# Altium project NeoCortex Alice.PrjPCB
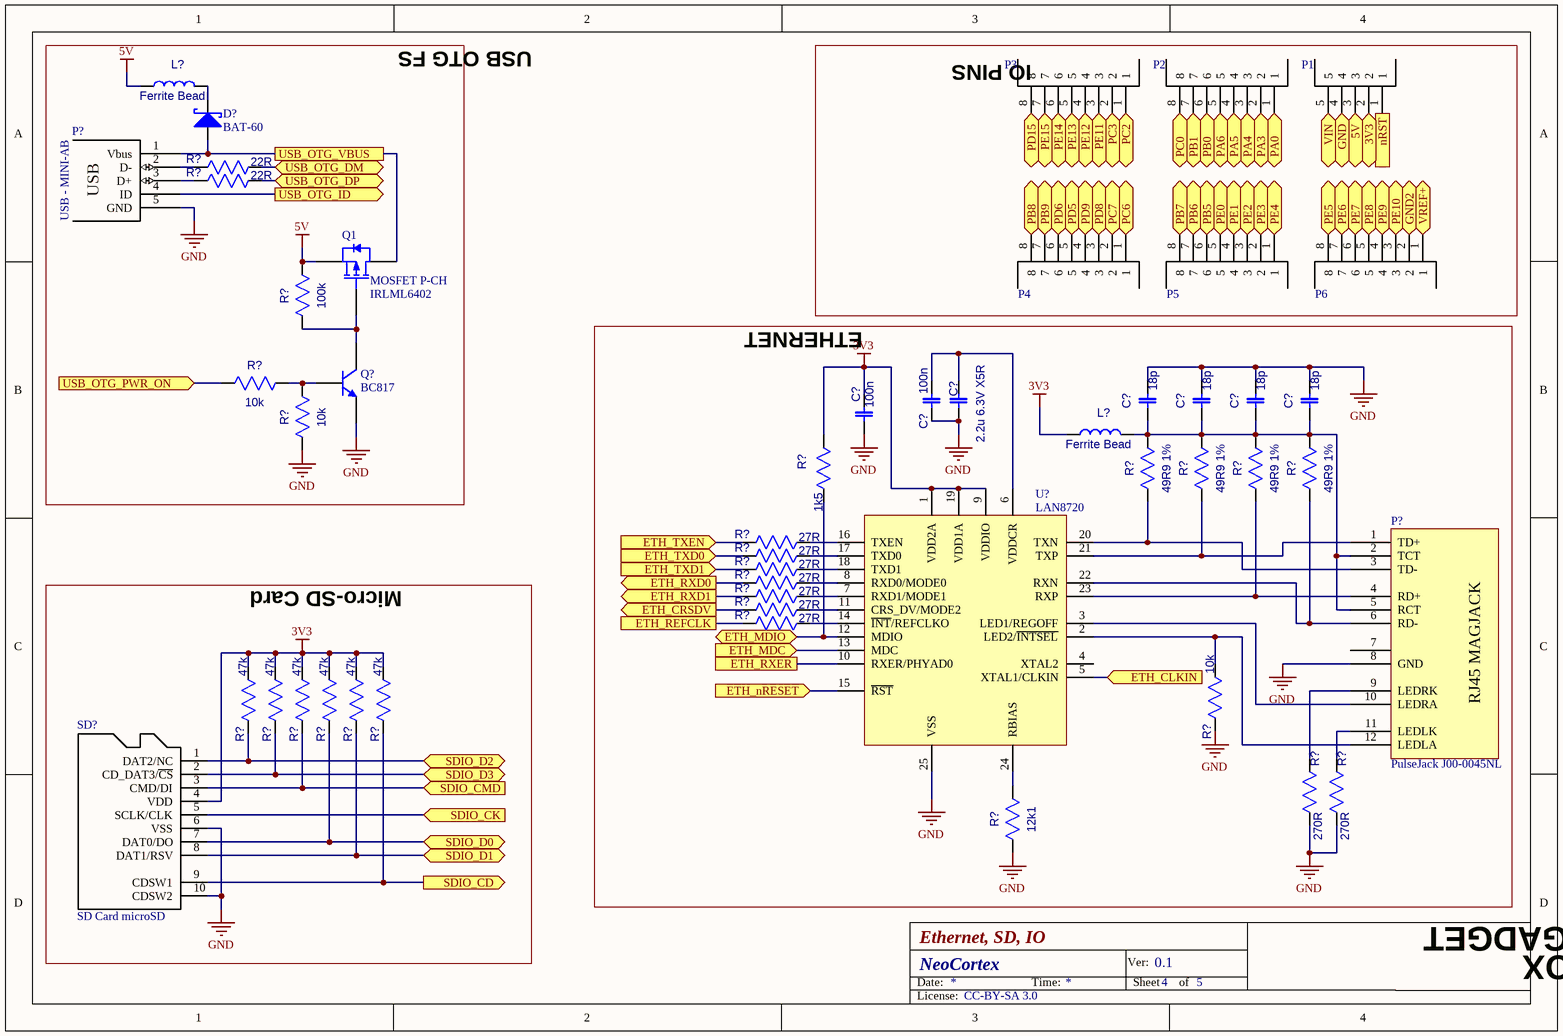
[diagram p0: Ethernet SD IO.SchDoc]
3 sheets, 55 parts. Net scope: hierarchical (ports join the sheet entries above them; power ports are global).
Board file: NeoCortex Alice.PcbDoc
Sheets:
  Ethernet SD IO.SchDoc
  NeoCortex.SchDoc
    U_Processor = Processor.SchDoc

## Sheet Ethernet SD IO.SchDoc: Ethernet, SD, IO
size A4; Organization: Gadget Sandbox; SheetNumber: 4; SheetTotal: 5; License: CC-BY-SA 3.0; Version: 0.1; Project: NeoCortex

### Parts
(Parts that share a designator on the sheet are numbered #1, #2 ... from top to bottom, then left to right.)
C?#1  2.2u 6.3V X5R  [CAP 0603]
C?#2  100n  [CAP 0805]
C?#3  18p  [CAP 0603]
C?#4  18p  [CAP 0603]
C?#5  18p  [CAP 0603]
C?#6  18p  [CAP 0603]
C?#7  100n  [CAP 0603]
D?  BAT-60  [SOD-323]
L?#1  Ferrite Bead  [IND 0603]
L?#2  Ferrite Bead  [IND 0603]
P1  CONN - 5W  [Header Female 05 2.54]  (value not drawn)
P2  CONN - 8W  [TERM-PL-8 3.81]  (value not drawn)
P3  CONN - 8W  [TERM-PL-8 3.81]  (value not drawn)
P4  CONN - 8W  [TERM-PL-8 3.81]  (value not drawn)
P5  CONN - 8W  [TERM-PL-8 3.81]  (value not drawn)
P6  CONN - 8W  [TERM-PL-8 3.81]  (value not drawn)
P?#1  USB - MINI-AB
P?#2  PulseJack J00-0045NL  [RJ45 MAGJACK STARJACK]
Q1  MOSFET P-CH  Comp2: IRLML6402  [SOT-23]
Q?  BC817  [SOT-23]
R?#1  22R  [RES 0603]
R?#2  22R  [RES 0603]
R?#3  100k  [RES 0603]
R?#4  10k  [RES 0603]
R?#5  10k  [RES 0603]
R?#6  1k5  [RES 0603]
R?#7  49R9 1%  [RES 0603]
R?#8  49R9 1%  [RES 0603]
R?#9  49R9 1%  [RES 0603]
R?#10  49R9 1%  [RES 0603]
R?#11  27R  [RES 0603]
R?#12  27R  [RES 0603]
R?#13  27R  [RES 0603]
R?#14  27R  [RES 0603]
R?#15  27R  [RES 0603]
R?#16  27R  [RES 0603]
R?#17  27R  [RES 0603]
R?#18  47k  [RES 0603]
R?#19  47k  [RES 0603]
R?#20  47k  [RES 0603]
R?#21  47k  [RES 0603]
R?#22  47k  [RES 0603]
R?#23  47k  [RES 0603]
R?#24  10k  [RES 0603]
R?#25  270R  [RES 0603]
R?#26  270R  [RES 0603]
R?#27  12k1  [RES 0603]
SD?  SD Card microSD  [SD CARD microSD 3]
U?#1  LAN8720  [QFN-24 (4x4)]

### Blocks framed on the sheet
USB OTG FS: D? L?#1 P?#1 Q1 Q? R?#1-R?#5
IO PINS: P1-P6
ETHERNET: C?#1-C?#7 L?#2 P?#2 R?#6-R?#17 R?#24-R?#27 U?#1
Micro-SD Card: R?#18-R?#23 SD?

### Ports
3V3 (bidir), 5V (bidir), ETH_CLKIN (in), ETH_CRSDV (out), ETH_MDC (in), ETH_MDIO (bidir), ETH_nRESET (in), ETH_REFCLK, ETH_RXD0 (out), ETH_RXD1 (out), ETH_RXER, ETH_TXD0 (in), ETH_TXD1 (in), ETH_TXEN (in), GND2 (bidir), GND (bidir), nRST (in), PA0 (bidir), PA3 (bidir), PA4 (bidir), PA5 (bidir), PA6 (bidir), PB0 (bidir), PB1 (bidir), PB5 (bidir), PB6 (bidir), PB7 (bidir), PB8 (bidir), PB9 (bidir), PC0 (bidir), PC2 (bidir), PC3 (bidir), PC6 (bidir), PC7 (bidir), PD5 (bidir), PD6 (bidir), PD8 (bidir), PD9 (bidir), PD15 (bidir), PE0 (bidir), PE1 (bidir), PE2 (bidir), PE3 (bidir), PE4 (bidir), PE5 (bidir), PE6 (bidir), PE7 (bidir), PE8 (bidir), PE9 (bidir), PE10 (bidir), PE11 (bidir), PE12 (bidir), PE13 (bidir), PE14 (bidir), PE15 (bidir), SDIO_CD (out), SDIO_CK (in), SDIO_CMD (in), SDIO_D0 (bidir), SDIO_D1 (bidir), SDIO_D2 (bidir), SDIO_D3 (bidir), USB_OTG_DM (bidir), USB_OTG_DP (bidir), USB_OTG_ID (out), USB_OTG_PWR_ON (in), USB_OTG_VBUS, VIN (bidir), VREF+ (bidir)

### Nets
3V3: C?#7.2 L?#2.1 R?#6.1 R?#18.1 R?#19.1 R?#20.1 R?#21.1 R?#22.1 R?#23.1 SD?.4(VDD) U?#1.1(VDD2A) U?#1.9(VDDIO) U?#1.19(VDD1A)
5V: L?#1.1 Q1.2(S) R?#3.1
GND: C?#1.2 C?#2.1 C?#3.2 C?#4.2 C?#5.2 C?#6.2 C?#7.1 P?#1.5(GND) P?#2.8(GND) Q?.2(E) R?#5.2 R?#24.2 R?#25.2 R?#26.2 R?#27.2 SD?.6(VSS) SD?.10(CDSW2) U?#1.25(VSS)
NetC?#1_1: C?#1.1 C?#2.2 U?#1.6(VDDCR)
NetC?#3_1: C?#3.1 C?#4.1 C?#5.1 C?#6.1 L?#2.2 P?#2.2(TCT) P?#2.5(RCT) R?#7.1 R?#8.1 R?#9.1 R?#10.1
NetD?_1: D?.1(A) P?#1.1(Vbus) Q1.3(D) ; port USB_OTG_VBUS
NetD?_2: D?.2(K) L?#1.2
NetP1_1: P1.1 ; port nRST
NetP1_2: P1.2 ; port 3V3
NetP1_3: P1.3 ; port 5V
NetP1_4: P1.4 ; port GND
NetP1_5: P1.5 ; port VIN
NetP2_1: P2.1 ; port PA0
NetP2_2: P2.2 ; port PA3
NetP2_3: P2.3 ; port PA4
NetP2_4: P2.4 ; port PA5
NetP2_5: P2.5 ; port PA6
NetP2_6: P2.6 ; port PB0
NetP2_7: P2.7 ; port PB1
NetP2_8: P2.8 ; port PC0
NetP3_1: P3.1 ; port PC2
NetP3_2: P3.2 ; port PC3
NetP3_3: P3.3 ; port PE11
NetP3_4: P3.4 ; port PE12
NetP3_5: P3.5 ; port PE13
NetP3_6: P3.6 ; port PE14
NetP3_7: P3.7 ; port PE15
NetP3_8: P3.8 ; port PD15
NetP4_1: P4.1 ; port PC6
NetP4_2: P4.2 ; port PC7
NetP4_3: P4.3 ; port PD8
NetP4_4: P4.4 ; port PD9
NetP4_5: P4.5 ; port PD5
NetP4_6: P4.6 ; port PD6
NetP4_7: P4.7 ; port PB9
NetP4_8: P4.8 ; port PB8
NetP5_1: P5.1 ; port PE4
NetP5_2: P5.2 ; port PE3
NetP5_3: P5.3 ; port PE2
NetP5_4: P5.4 ; port PE1
NetP5_5: P5.5 ; port PE0
NetP5_6: P5.6 ; port PB5
NetP5_7: P5.7 ; port PB6
NetP5_8: P5.8 ; port PB7
NetP6_1: P6.1 ; port VREF+
NetP6_2: P6.2 ; port GND2
NetP6_3: P6.3 ; port PE10
NetP6_4: P6.4 ; port PE9
NetP6_5: P6.5 ; port PE8
NetP6_6: P6.6 ; port PE7
NetP6_7: P6.7 ; port PE6
NetP6_8: P6.8 ; port PE5
NetP?#1_2: P?#1.2(D-) R?#1.2
NetP?#1_3: P?#1.3(D+) R?#2.2
NetP?#1_4: P?#1.4(ID) ; port USB_OTG_ID
NetP?#2_1: P?#2.1(TD+) R?#8.2 U?#1.21(TXP)
NetP?#2_3: P?#2.3(TD-) R?#7.2 U?#1.20(TXN)
NetP?#2_4: P?#2.4(RD+) R?#9.2 U?#1.23(RXP)
NetP?#2_6: P?#2.6(RD-) R?#10.2 U?#1.22(RXN)
NetP?#2_9: P?#2.9(LEDRK) R?#25.1
NetP?#2_10: P?#2.10(LEDRA) U?#1.3(LED1/REGOFF)
NetP?#2_11: P?#2.11(LEDLK) R?#26.1
NetP?#2_12: P?#2.12(LEDLA) R?#24.1 U?#1.2(LED2/~{INTSEL})
NetQ1_1: Q1.1(G) Q?.3(C) R?#3.2
NetQ?_1: Q?.1(B) R?#4.1 R?#5.1
NetR?#1_1: R?#1.1 ; port USB_OTG_DM
NetR?#2_1: R?#2.1 ; port USB_OTG_DP
NetR?#4_2: R?#4.2 ; port USB_OTG_PWR_ON
NetR?#6_2: R?#6.2 U?#1.12(MDIO) ; port ETH_MDIO
NetR?#11_1: R?#11.1 U?#1.16(TXEN)
NetR?#11_2: R?#11.2 ; port ETH_TXEN
NetR?#12_1: R?#12.1 U?#1.17(TXD0)
NetR?#12_2: R?#12.2 ; port ETH_TXD0
NetR?#13_1: R?#13.1 U?#1.18(TXD1)
NetR?#13_2: R?#13.2 ; port ETH_TXD1
NetR?#14_1: R?#14.1 U?#1.8(RXD0/MODE0)
NetR?#14_2: R?#14.2 ; port ETH_RXD0
NetR?#15_1: R?#15.1 U?#1.7(RXD1/MODE1)
NetR?#15_2: R?#15.2 ; port ETH_RXD1
NetR?#16_1: R?#16.1 U?#1.11(CRS_DV/MODE2)
NetR?#16_2: R?#16.2 ; port ETH_CRSDV
NetR?#17_1: R?#17.1 U?#1.14(~{INT}/REFCLKO)
NetR?#17_2: R?#17.2 ; port ETH_REFCLK
NetR?#18_2: R?#18.2 SD?.1(DAT2/NC) ; port SDIO_D2
NetR?#19_2: R?#19.2 SD?.2(CD_DAT3/~{CS}) ; port SDIO_D3
NetR?#20_2: R?#20.2 SD?.3(CMD/DI) ; port SDIO_CMD
NetR?#21_2: R?#21.2 SD?.7(DAT0/DO) ; port SDIO_D0
NetR?#22_2: R?#22.2 SD?.8(DAT1/RSV) ; port SDIO_D1
NetR?#23_2: R?#23.2 SD?.9(CDSW1) ; port SDIO_CD
NetR?#27_1: R?#27.1 U?#1.24(RBIAS)
NetSD?_5: SD?.5(SCLK/CLK) ; port SDIO_CK
NetU?#1_5: U?#1.5(XTAL1/CLKIN) ; port ETH_CLKIN
NetU?#1_10: U?#1.10(RXER/PHYAD0) ; port ETH_RXER
NetU?#1_13: U?#1.13(MDC) ; port ETH_MDC
NetU?#1_15: U?#1.15(~{RST}) ; port ETH_nRESET

Not connected (* = marked no-connect by the designer): P?#2 7; U?#1 4(XTAL2)

### Notes on the sheet
- Date:
- Time:
- Ver:
- Sheet
- of
- GADGET
- SANDBOX
- License:
- (in symbol USB - MINI-AB) USB

### Library data of the parts
C?#1-C?#7 = Capacitor Ceramic
  C?#1: Value: 2.2u 6.3V X5R
  C?#2 C?#7: Value: 100n
  C?#3-C?#6: Value: 18p
D? = Diode Schottky: Schottky; Value: BAT54-G (SOT-23); DiodesInc: 1N5819 (SOD-123); DiodesInc2: BAT60 (SOD-323)
L?#1 L?#2 = Inductor: Value: Ferrite Bead
P?#1 = USB - MINI-AB: USB OTG MINI-AB
P?#2 = RJ45 MAGJACK: RJ45 Jack with Magnetics; pin to pad: 2>4 3>2 4>3 9>10 10>9; PulseElectronic: PulseJack J00-0045NL
Q1 = MOSFET P-CHANNEL: P-channel MOSFET; Comp1: PMV65XP
Q? = Transistor NPN: NPN Bipolar Transistor; Comp1: BC817
R?#1-R?#27 = Resistor
  R?#1 R?#2: Value: 22R
  R?#3: Value: 100k
  R?#4 R?#5 R?#24: Value: 10k
  R?#6: Value: 1k5
  R?#7-R?#10: Value: 49R9 1%
  R?#11-R?#17: Value: 27R
  R?#18-R?#23: Value: 47k
  R?#25 R?#26: Value: 270R
  R?#27: Value: 12k1
U?#1 = LAN8720: RMII 10/100 ethernet interface
P2-P6 = CONN - 8W: Value: *; Name: *

## Sheet NeoCortex.SchDoc: NeoCortex
size A4; Organization: Altium Limited; SheetNumber: 1; SheetTotal: 5; License: CC-BY-SA 3.0; Version: 0.1; Project: NeoCortex
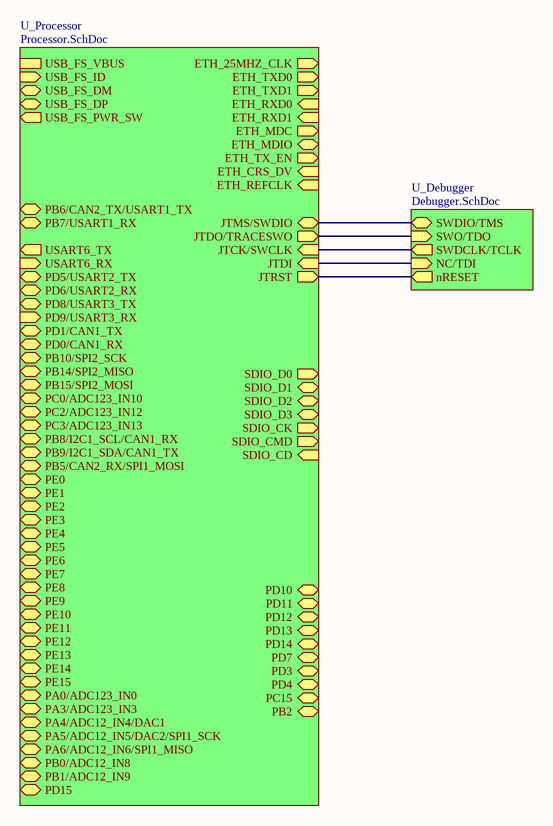
[diagram p1: NeoCortex.SchDoc]

### Sub-sheets
U_Debugger = Debugger.SchDoc (file not in this document): SWDIO/TMS (bidir), SWDCLK/TCLK (out), SWO/TDO (in), nRESET (out), NC/TDI (in)
U_Processor = Processor.SchDoc: SDIO_CD (in), SDIO_D0 (out), SDIO_D1 (bidir), SDIO_D2 (bidir), SDIO_D3 (bidir), SDIO_CK (out), SDIO_CMD (out), USB_FS_VBUS, USB_FS_ID (in), USB_FS_DM (bidir), USB_FS_DP (bidir), ETH_25MHZ_CLK (out), ETH_REFCLK (in), ETH_MDIO (bidir), ETH_RXD0 (in), ETH_RXD1 (in), ETH_TXD0 (out), ETH_TXD1 (out), ETH_CRS_DV (in), ETH_MDC (out), ETH_TX_EN (out), PB6/CAN2_TX/USART1_TX (bidir), PB7/USART1_RX (bidir), USART6_TX (out), USART6_RX (in), PD5/USART2_TX (bidir), PD6/USART2_RX (bidir), PD8/USART3_TX (bidir), PD9/USART3_RX (in), PD1/CAN1_TX (bidir), PD0/CAN1_RX (bidir), PB10/SPI2_SCK (bidir), PB14/SPI2_MISO (bidir), PB15/SPI2_MOSI (bidir), PC0/ADC123_IN10 (bidir), PC2/ADC123_IN12 (bidir), PC3/ADC123_IN13 (bidir), PB8/I2C1_SCL/CAN1_RX (bidir), PB9/I2C1_SDA/CAN1_TX (bidir), PB5/CAN2_RX/SPI1_MOSI (bidir), PE0 (bidir), PE1 (bidir), PE2 (bidir), PE3 (bidir), PE4 (bidir), PE5 (bidir), PE6 (bidir), PE7 (bidir), PE8 (bidir), PE9 (bidir), PE10 (bidir), PE11 (bidir), PE12 (bidir), PE13 (bidir), PE14 (bidir), PE15 (bidir), PA0/ADC123_IN0 (bidir), PA3/ADC123_IN3 (bidir), PA4/ADC12_IN4/DAC1 (bidir), PA5/ADC12_IN5/DAC2/SPI1_SCK (bidir), PA6/ADC12_IN6/SPI1_MISO (bidir), PB0/ADC12_IN8 (bidir), PB1/ADC12_IN9 (bidir), USB_FS_PWR_SW (out), PD15 (bidir), JTMS/SWDIO (bidir), JTCK/SWCLK (in), JTDO/TRACESWO (out), JTRST (out), JTDI (in), PD10 (bidir), PD11 (bidir), PD12 (bidir), PD13 (bidir), PD14 (bidir), PD7 (bidir), PD3 (bidir), PD4 (bidir), PC15 (bidir), PB2 (bidir)

### Nets
NetU?#3_72: sheet U_Processor/JTMS/SWDIO, sheet U_Debugger/SWDIO/TMS
NetU?#3_76: sheet U_Processor/JTCK/SWCLK, sheet U_Debugger/SWDCLK/TCLK
NetU?#3_77: sheet U_Processor/JTDI, sheet U_Debugger/NC/TDI
NetU?#3_89: sheet U_Processor/JTDO/TRACESWO, sheet U_Debugger/SWO/TDO
NetU?#3_90: sheet U_Processor/JTRST, sheet U_Debugger/nRESET

### Notes on the sheet
- Date:
- Time:
- Ver:
- Sheet
- of
- GADGET
- SANDBOX
- License:

## Sheet Processor.SchDoc: MCU STM32F407VG6
size A4; Organization: Gadget Sandbox; SheetNumber: 3; SheetTotal: 5; License: CC-BY-SA 3.0; Version: 0.1 pre-alpha; Project: NeoCortex
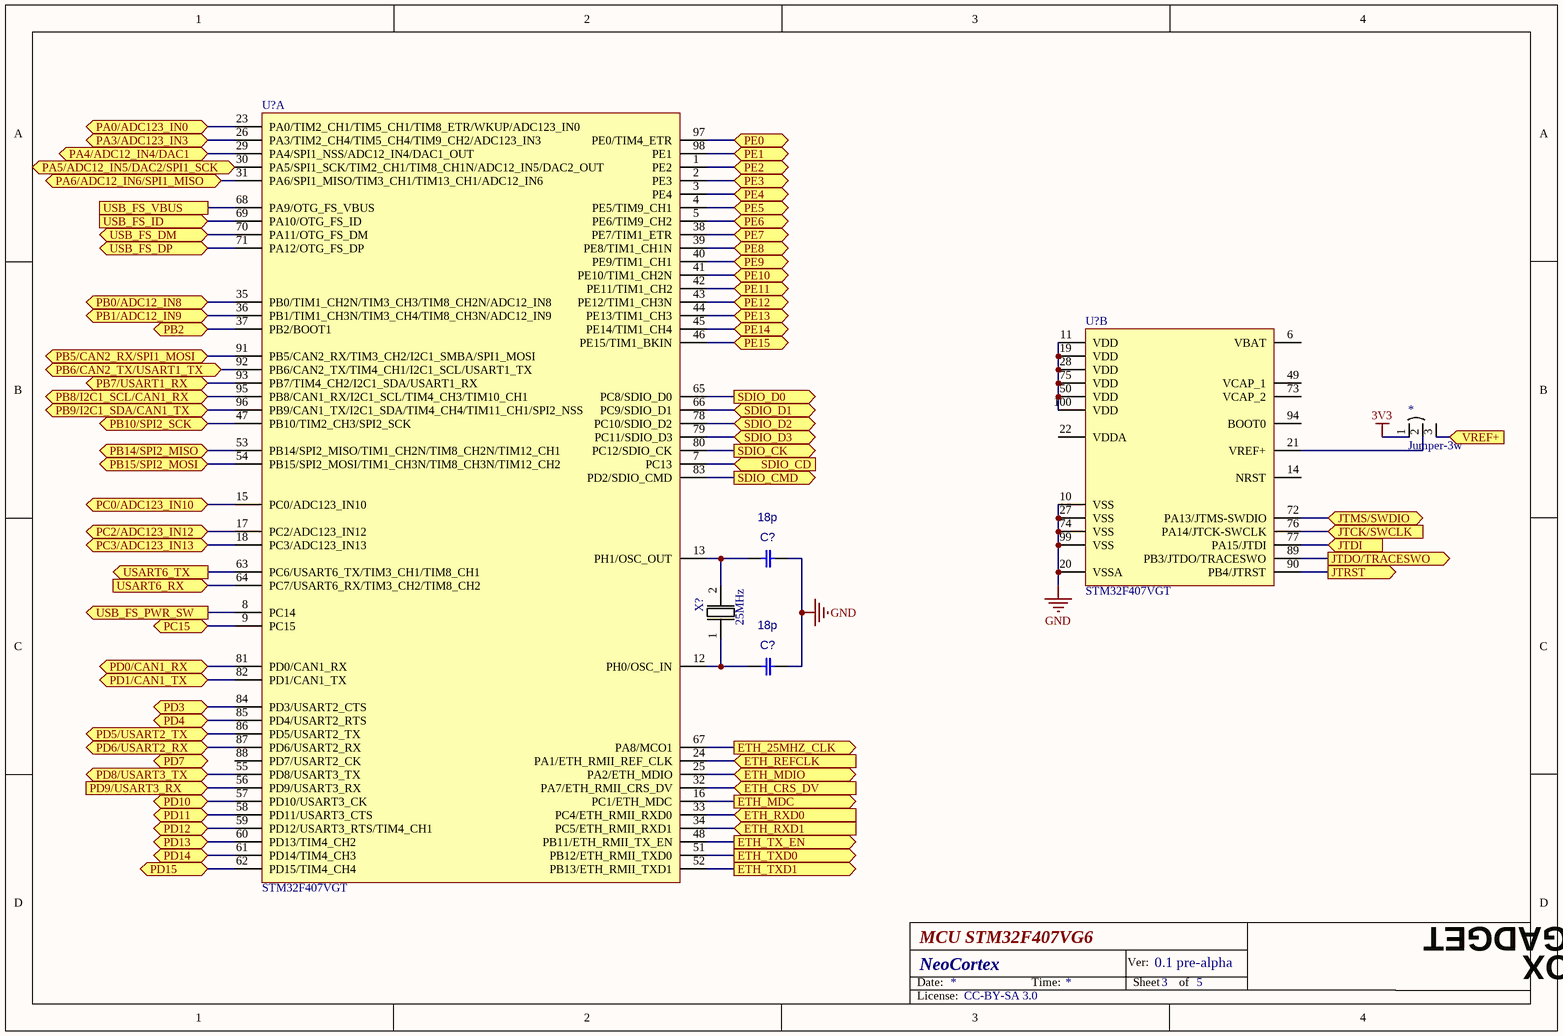
[diagram p2: Processor.SchDoc]

### Parts
(Parts that share a designator on the sheet are numbered #1, #2 ... from top to bottom, then left to right.)
*  Jumper-3w  [JMP-3W]
C?#8  18p  [CAP 0805]
C?#9  18p  [CAP 0805]
U?#2  STM32F407VGT  [LQFP-100 (14x14)]  (part A of 2)
U?#3  STM32F407VGT  [LQFP-100 (14x14)]  (part B of 2)
X?  25MHz  [Crystal SMU4]

### Ports
ETH_25MHZ_CLK (out), ETH_CRS_DV (in), ETH_MDC (out), ETH_MDIO (bidir), ETH_REFCLK (in), ETH_RXD0 (in), ETH_RXD1 (in), ETH_TX_EN (out), ETH_TXD0 (out), ETH_TXD1 (out), JTCK/SWCLK (in), JTDI (in), JTDO/TRACESWO (out), JTMS/SWDIO (bidir), JTRST (out), PA0/ADC123_IN0 (bidir), PA3/ADC123_IN3 (bidir), PA4/ADC12_IN4/DAC1 (bidir), PA5/ADC12_IN5/DAC2/SPI1_SCK (bidir), PA6/ADC12_IN6/SPI1_MISO (bidir), PB0/ADC12_IN8 (bidir), PB1/ADC12_IN9 (bidir), PB2 (bidir), PB5/CAN2_RX/SPI1_MOSI (bidir), PB6/CAN2_TX/USART1_TX (bidir), PB7/USART1_RX (bidir), PB8/I2C1_SCL/CAN1_RX (bidir), PB9/I2C1_SDA/CAN1_TX (bidir), PB10/SPI2_SCK (bidir), PB14/SPI2_MISO (bidir), PB15/SPI2_MOSI (bidir), PC0/ADC123_IN10 (bidir), PC2/ADC123_IN12 (bidir), PC3/ADC123_IN13 (bidir), PC15 (bidir), PD0/CAN1_RX (bidir), PD1/CAN1_TX (bidir), PD3 (bidir), PD4 (bidir), PD5/USART2_TX (bidir), PD6/USART2_RX (bidir), PD7 (bidir), PD8/USART3_TX (bidir), PD9/USART3_RX (in), PD10 (bidir), PD11 (bidir), PD12 (bidir), PD13 (bidir), PD14 (bidir), PD15 (bidir), PE0 (bidir), PE1 (bidir), PE2 (bidir), PE3 (bidir), PE4 (bidir), PE5 (bidir), PE6 (bidir), PE7 (bidir), PE8 (bidir), PE9 (bidir), PE10 (bidir), PE11 (bidir), PE12 (bidir), PE13 (bidir), PE14 (bidir), PE15 (bidir), SDIO_CD (in), SDIO_CK (out), SDIO_CMD (out), SDIO_D0 (out), SDIO_D1 (bidir), SDIO_D2 (bidir), SDIO_D3 (bidir), USART6_RX (in), USART6_TX (out), USB_FS_DM (bidir), USB_FS_DP (bidir), USB_FS_ID (in), USB_FS_PWR_SW (out), USB_FS_VBUS, VREF+ (in)

### Nets
3V3: *.1
GND: C?#8.2 C?#9.2 U?#3.10(VSS) U?#3.20(VSSA) U?#3.27(VSS) U?#3.74(VSS) U?#3.99(VSS)
Net*_2: *.2 U?#3.21(VREF+)
Net*_3: *.3 ; port VREF+
NetC?#8_1: C?#8.1 U?#2.13(PH1/OSC_OUT) X?.2
NetC?#9_1: C?#9.1 U?#2.12(PH0/OSC_IN) X?.1
NetU?#2_1: U?#2.1(PE2) ; port PE2
NetU?#2_2: U?#2.2(PE3) ; port PE3
NetU?#2_3: U?#2.3(PE4) ; port PE4
NetU?#2_4: U?#2.4(PE5/TIM9_CH1) ; port PE5
NetU?#2_5: U?#2.5(PE6/TIM9_CH2) ; port PE6
NetU?#2_7: U?#2.7(PC13) ; port SDIO_CD
NetU?#2_8: U?#2.8(PC14) ; port USB_FS_PWR_SW
NetU?#2_9: U?#2.9(PC15) ; port PC15
NetU?#2_15: U?#2.15(PC0/ADC123_IN10) ; port PC0/ADC123_IN10
NetU?#2_16: U?#2.16(PC1/ETH_MDC) ; port ETH_MDC
NetU?#2_17: U?#2.17(PC2/ADC123_IN12) ; port PC2/ADC123_IN12
NetU?#2_18: U?#2.18(PC3/ADC123_IN13) ; port PC3/ADC123_IN13
NetU?#2_23: U?#2.23(PA0/TIM2_CH1/TIM5_CH1/TIM8_ETR/WKUP/ADC123_IN0) ; port PA0/ADC123_IN0
NetU?#2_24: U?#2.24(PA1/ETH_RMII_REF_CLK) ; port ETH_REFCLK
NetU?#2_25: U?#2.25(PA2/ETH_MDIO) ; port ETH_MDIO
NetU?#2_26: U?#2.26(PA3/TIM2_CH4/TIM5_CH4/TIM9_CH2/ADC123_IN3) ; port PA3/ADC123_IN3
NetU?#2_29: U?#2.29(PA4/SPI1_NSS/ADC12_IN4/DAC1_OUT) ; port PA4/ADC12_IN4/DAC1
NetU?#2_30: U?#2.30(PA5/SPI1_SCK/TIM2_CH1/TIM8_CH1N/ADC12_IN5/DAC2_OUT) ; port PA5/ADC12_IN5/DAC2/SPI1_SCK
NetU?#2_31: U?#2.31(PA6/SPI1_MISO/TIM3_CH1/TIM13_CH1/ADC12_IN6) ; port PA6/ADC12_IN6/SPI1_MISO
NetU?#2_32: U?#2.32(PA7/ETH_RMII_CRS_DV) ; port ETH_CRS_DV
NetU?#2_33: U?#2.33(PC4/ETH_RMII_RXD0) ; port ETH_RXD0
NetU?#2_34: U?#2.34(PC5/ETH_RMII_RXD1) ; port ETH_RXD1
NetU?#2_35: U?#2.35(PB0/TIM1_CH2N/TIM3_CH3/TIM8_CH2N/ADC12_IN8) ; port PB0/ADC12_IN8
NetU?#2_36: U?#2.36(PB1/TIM1_CH3N/TIM3_CH4/TIM8_CH3N/ADC12_IN9) ; port PB1/ADC12_IN9
NetU?#2_37: U?#2.37(PB2/BOOT1) ; port PB2
NetU?#2_38: U?#2.38(PE7/TIM1_ETR) ; port PE7
NetU?#2_39: U?#2.39(PE8/TIM1_CH1N) ; port PE8
NetU?#2_40: U?#2.40(PE9/TIM1_CH1) ; port PE9
NetU?#2_41: U?#2.41(PE10/TIM1_CH2N) ; port PE10
NetU?#2_42: U?#2.42(PE11/TIM1_CH2) ; port PE11
NetU?#2_43: U?#2.43(PE12/TIM1_CH3N) ; port PE12
NetU?#2_44: U?#2.44(PE13/TIM1_CH3) ; port PE13
NetU?#2_45: U?#2.45(PE14/TIM1_CH4) ; port PE14
NetU?#2_46: U?#2.46(PE15/TIM1_BKIN) ; port PE15
NetU?#2_47: U?#2.47(PB10/TIM2_CH3/SPI2_SCK) ; port PB10/SPI2_SCK
NetU?#2_48: U?#2.48(PB11/ETH_RMII_TX_EN) ; port ETH_TX_EN
NetU?#2_51: U?#2.51(PB12/ETH_RMII_TXD0) ; port ETH_TXD0
NetU?#2_52: U?#2.52(PB13/ETH_RMII_TXD1) ; port ETH_TXD1
NetU?#2_53: U?#2.53(PB14/SPI2_MISO/TIM1_CH2N/TIM8_CH2N/TIM12_CH1) ; port PB14/SPI2_MISO
NetU?#2_54: U?#2.54(PB15/SPI2_MOSI/TIM1_CH3N/TIM8_CH3N/TIM12_CH2) ; port PB15/SPI2_MOSI
NetU?#2_55: U?#2.55(PD8/USART3_TX) ; port PD8/USART3_TX
NetU?#2_56: U?#2.56(PD9/USART3_RX) ; port PD9/USART3_RX
NetU?#2_57: U?#2.57(PD10/USART3_CK) ; port PD10
NetU?#2_58: U?#2.58(PD11/USART3_CTS) ; port PD11
NetU?#2_59: U?#2.59(PD12/USART3_RTS/TIM4_CH1) ; port PD12
NetU?#2_60: U?#2.60(PD13/TIM4_CH2) ; port PD13
NetU?#2_61: U?#2.61(PD14/TIM4_CH3) ; port PD14
NetU?#2_62: U?#2.62(PD15/TIM4_CH4) ; port PD15
NetU?#2_63: U?#2.63(PC6/USART6_TX/TIM3_CH1/TIM8_CH1) ; port USART6_TX
NetU?#2_64: U?#2.64(PC7/USART6_RX/TIM3_CH2/TIM8_CH2) ; port USART6_RX
NetU?#2_65: U?#2.65(PC8/SDIO_D0) ; port SDIO_D0
NetU?#2_66: U?#2.66(PC9/SDIO_D1) ; port SDIO_D1
NetU?#2_67: U?#2.67(PA8/MCO1) ; port ETH_25MHZ_CLK
NetU?#2_68: U?#2.68(PA9/OTG_FS_VBUS) ; port USB_FS_VBUS
NetU?#2_69: U?#2.69(PA10/OTG_FS_ID) ; port USB_FS_ID
NetU?#2_70: U?#2.70(PA11/OTG_FS_DM) ; port USB_FS_DM
NetU?#2_71: U?#2.71(PA12/OTG_FS_DP) ; port USB_FS_DP
NetU?#2_78: U?#2.78(PC10/SDIO_D2) ; port SDIO_D2
NetU?#2_79: U?#2.79(PC11/SDIO_D3) ; port SDIO_D3
NetU?#2_80: U?#2.80(PC12/SDIO_CK) ; port SDIO_CK
NetU?#2_81: U?#2.81(PD0/CAN1_RX) ; port PD0/CAN1_RX
NetU?#2_82: U?#2.82(PD1/CAN1_TX) ; port PD1/CAN1_TX
NetU?#2_83: U?#2.83(PD2/SDIO_CMD) ; port SDIO_CMD
NetU?#2_84: U?#2.84(PD3/USART2_CTS) ; port PD3
NetU?#2_85: U?#2.85(PD4/USART2_RTS) ; port PD4
NetU?#2_86: U?#2.86(PD5/USART2_TX) ; port PD5/USART2_TX
NetU?#2_87: U?#2.87(PD6/USART2_RX) ; port PD6/USART2_RX
NetU?#2_91: U?#2.91(PB5/CAN2_RX/TIM3_CH2/I2C1_SMBA/SPI1_MOSI) ; port PB5/CAN2_RX/SPI1_MOSI
NetU?#2_92: U?#2.92(PB6/CAN2_TX/TIM4_CH1/I2C1_SCL/USART1_TX) ; port PB6/CAN2_TX/USART1_TX
NetU?#2_93: U?#2.93(PB7/TIM4_CH2/I2C1_SDA/USART1_RX) ; port PB7/USART1_RX
NetU?#2_95: U?#2.95(PB8/CAN1_RX/I2C1_SCL/TIM4_CH3/TIM10_CH1) ; port PB8/I2C1_SCL/CAN1_RX
NetU?#2_96: U?#2.96(PB9/CAN1_TX/I2C1_SDA/TIM4_CH4/TIM11_CH1/SPI2_NSS) ; port PB9/I2C1_SDA/CAN1_TX
NetU?#2_97: U?#2.97(PE0/TIM4_ETR) ; port PE0
NetU?#2_98: U?#2.98(PE1) ; port PE1
NetU?#3_11: U?#3.11(VDD) U?#3.19(VDD) U?#3.28(VDD) U?#3.50(VDD) U?#3.75(VDD) U?#3.100(VDD)
NetU?#3_72: U?#3.72(PA13/JTMS-SWDIO) ; port JTMS/SWDIO
NetU?#3_76: U?#3.76(PA14/JTCK-SWCLK) ; port JTCK/SWCLK
NetU?#3_77: U?#3.77(PA15/JTDI) ; port JTDI
NetU?#3_89: U?#3.89(PB3/JTDO/TRACESWO) ; port JTDO/TRACESWO
NetU?#3_90: U?#3.90(PB4/JTRST) ; port JTRST

Not connected (* = marked no-connect by the designer): U?#2 88(PD7/USART2_CK); U?#3 6(VBAT) 14(NRST) 22(VDDA) 49(VCAP_1) 73(VCAP_2) 94(BOOT0)

### Notes on the sheet
- Date:
- Time:
- Ver:
- Sheet
- of
- GADGET
- SANDBOX
- License:

### Library data of the parts
C?#8 C?#9 = Capacitor Ceramic: Value: 18p
U?#2 U?#3 = STM32F407VGT: ARM Cortex-M4 32b MCU+FPU, 210DMIPS, up to 1MB Flash/192+4KB RAM,  USB OTG HS/FS, Ethernet, 17 TIMs, 3 ADCs, 15 comm. interfaces & camera
X? = Crystal: Value: 25MHz

## Nets that join several sheets
3V3: Ethernet SD IO (13 pins), Processor (*.1)
GND: Ethernet SD IO (18 pins), Processor (7 pins)